# EAGLE design pecl_sampler_v3 (EAGLE 9.4.1)
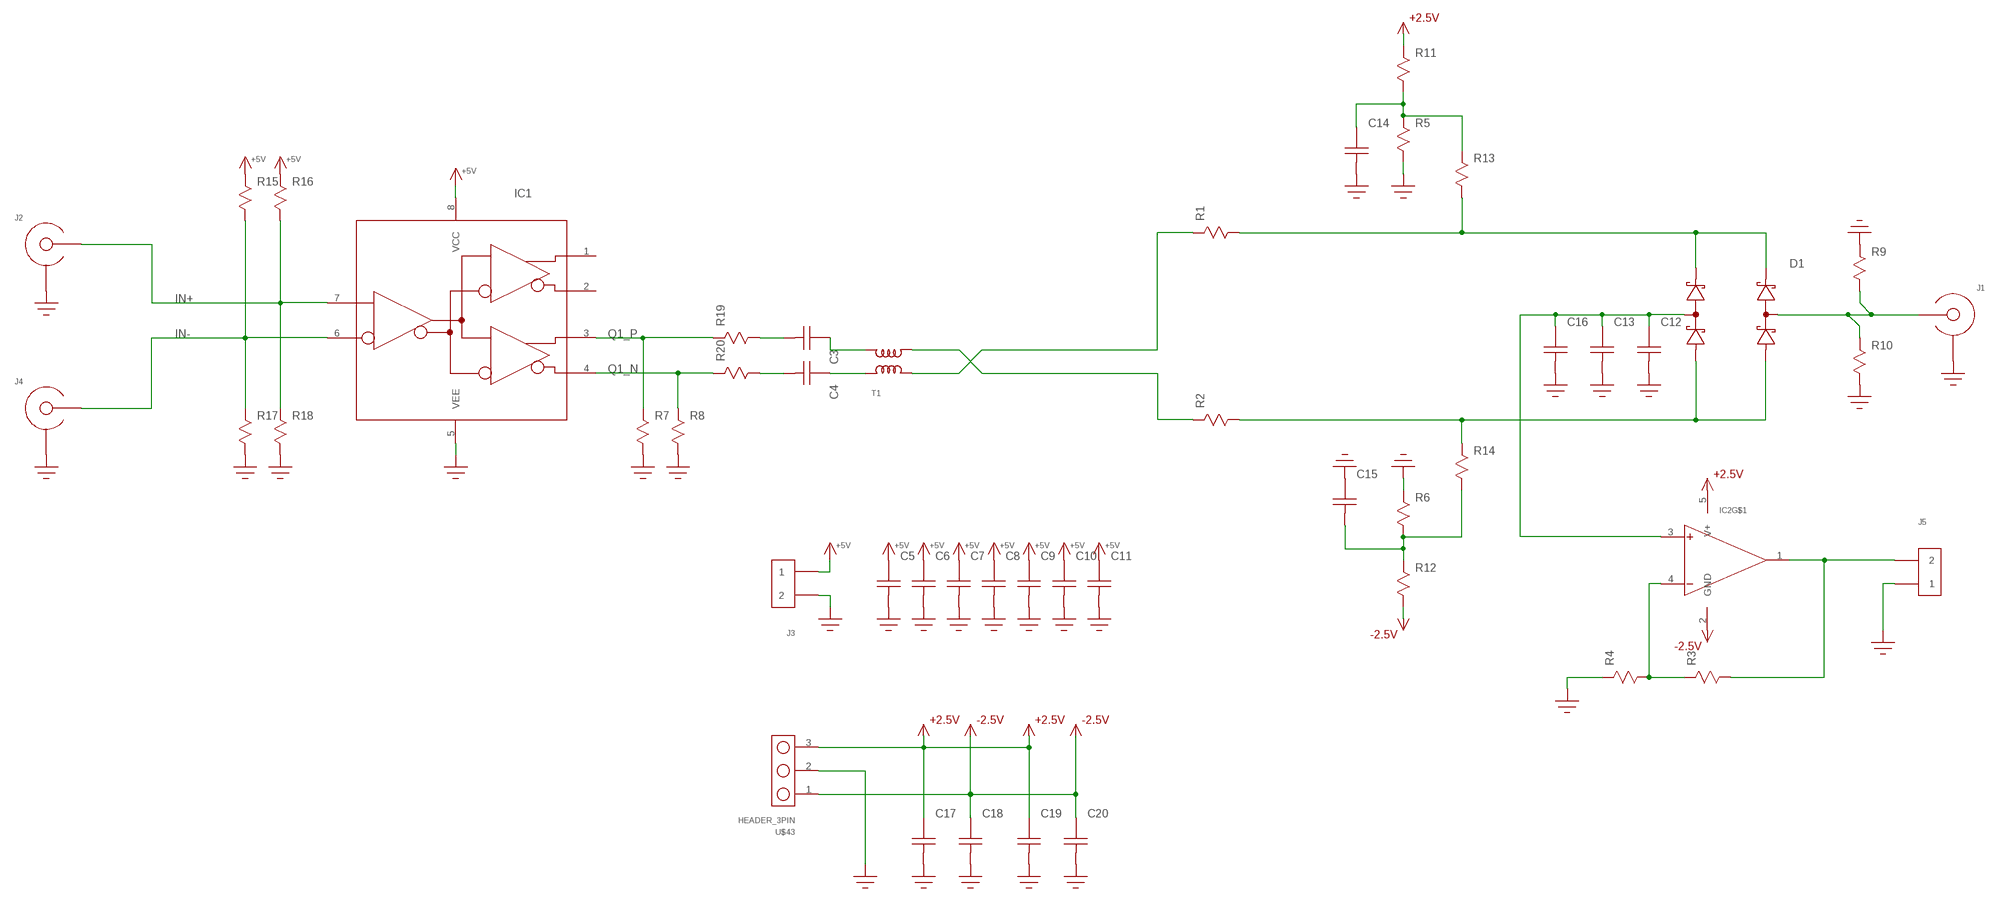
[diagram p0: schematic, sheet 1]

## Parts
C3  C  [C0402]
C4  C  [C0402]
C5  C0603  [C0603]
C6  C0603  [C0603]
C7  C0805  [0805]
C8  C0603  [C0603]
C9  C0603  [C0603]
C10  C0603  [C0603]
C11  C0603  [C0603]
C12  C  [C0402]
C13  C  [C0402]
C14  C  [C0402]
C15  C  [C0402]
C16  C  [C0402]
C17  C0603  [C0603]
C18  C0603  [C0603]
C19  C0603  [C0603]
C20  C0603  [C0603]
D1  SMS3923-081  [SC-88]
IC1  SY10EP89V  [SOIC8]
IC2  MCP6V81  [SOT23-5]
J1  SMA-EDGE-LAUNCH4L-4020-TAPER-FIXED  [SMA_EDGE_LAUNCH_4L_4020_TAPER_FIXED]
J2  SMA-EDGE-LAUNCH4L-4020-TAPER-FIXED  [SMA_EDGE_LAUNCH_4L_4020_TAPER_FIXED]
J3  HEADER_2PIN  [HEADER_2PIN]
J4  SMA-EDGE-LAUNCH4L-4020-TAPER-FIXED  [SMA_EDGE_LAUNCH_4L_4020_TAPER_FIXED]
J5  HEADER_2PIN  [HEADER_2PIN]
R1  R0402  [0402]
R2  R0402  [0402]
R3  R0603  [R0603]
R4  R0603  [R0603]
R5  R0603  [R0603]
R6  R0603  [R0603]
R7  R0603  [R0603]
R8  R0603  [R0603]
R9  R0402  [0402]
R10  R0402  [0402]
R11  R0603  [R0603]
R12  R0603  [R0603]
R13  R0402  [0402]
R14  R0402  [0402]
R15  R0603  [R0603]
R16  R0603  [R0603]
R17  R0603  [R0603]
R18  R0603  [R0603]
R19  R0402  [0402]
R20  R0402  [0402]
T1  MABA007159  [MABAES0061]
U$43  HEADER_3PIN  [HEADER_3PIN]

## Nets
+2.5V: C17.P$2 C19.P$2 IC2.5(V+) R11.P$1 U$43.3
+5V: C5.P$2 C6.P$2 C7.P$2 C8.P$2 C9.P$2 C10.P$2 C11.P$2 IC1.8(VCC) J3.1 R15.P$1 R16.P$1
-2.5V: C18.P$2 C20.P$2 IC2.2(GND) R12.P$2 U$43.1
GND: C5.P$1 C6.P$1 C7.P$1 C8.P$1 C9.P$1 C10.P$1 C11.P$1 C12.1 C13.1 C14.1 C15.2 C16.1 C17.P$1 C18.P$1 C19.P$1 C20.P$1 IC1.5(VEE) J1.BOTTOM_GND(SHIELD) J1.GND@1(SHIELD) J1.GND@2(SHIELD) J1.GND@3(SHIELD) J1.GND@4(SHIELD) J1.GND@5(SHIELD) J1.GND@6(SHIELD) J1.GND@7(SHIELD) J1.GND@8(SHIELD) J1.GND@14(SHIELD) J1.GND@15(SHIELD) J1.GND@16(SHIELD) J1.GND@17(SHIELD) J1.GND_PAD1(SHIELD) J1.GND_PAD2(SHIELD) J1.P$1(SHIELD) J1.P$2(SHIELD) J2.BOTTOM_GND(SHIELD) J2.GND@1(SHIELD) J2.GND@2(SHIELD) J2.GND@3(SHIELD) J2.GND@4(SHIELD) J2.GND@5(SHIELD) J2.GND@6(SHIELD) J2.GND@7(SHIELD) J2.GND@8(SHIELD) J2.GND@14(SHIELD) J2.GND@15(SHIELD) J2.GND@16(SHIELD) J2.GND@17(SHIELD) J2.GND_PAD1(SHIELD) J2.GND_PAD2(SHIELD) J2.P$1(SHIELD) J2.P$2(SHIELD) J3.2 J4.BOTTOM_GND(SHIELD) J4.GND@1(SHIELD) J4.GND@2(SHIELD) J4.GND@3(SHIELD) J4.GND@4(SHIELD) J4.GND@5(SHIELD) J4.GND@6(SHIELD) J4.GND@7(SHIELD) J4.GND@8(SHIELD) J4.GND@14(SHIELD) J4.GND@15(SHIELD) J4.GND@16(SHIELD) J4.GND@17(SHIELD) J4.GND_PAD1(SHIELD) J4.GND_PAD2(SHIELD) J4.P$1(SHIELD) J4.P$2(SHIELD) J5.1 R4.P$1 R5.P$2 R6.P$1 R7.P$2 R8.P$2 R9.1 R10.2 R17.P$2 R18.P$2 U$43.2
IN+: IC1.7(D) J2.CENTER@1(CENTER) J2.P$3(CENTER) R16.P$2 R18.P$1
IN-: IC1.6(!D!) J4.CENTER@1(CENTER) J4.P$3(CENTER) R15.P$2 R17.P$1
N$1: C14.2 R5.P$1 R11.P$2 R13.1
N$2: C12.2 C13.2 C16.2 D1.5(COMMON1) IC2.3(+)
N$3: C4.2 T1.5
N$4: D1.2(COMMON0) J1.CENTER@1(CENTER) J1.P$3(CENTER) R9.2 R10.1
N$5: C15.1 R6.P$2 R12.P$1 R14.2
N$6: C3.2 T1.4
N$7: D1.3(CATHODE0) D1.4(CATHODE1) R1.2 R13.2
N$8: R1.1 T1.1
N$9: R2.1 T1.3
N$10: D1.1(ANODE0) D1.6(ANODE1) R2.2 R14.1
N$11: C3.1 R19.2
N$12: C4.1 R20.2
N$13: IC2.4(-) R3.P$1 R4.P$2
N$16: IC2.1(OUT) J5.2 R3.P$2
Q1_N: IC1.4(!Q1!) R8.P$1 R20.1
Q1_P: IC1.3(Q1) R7.P$1 R19.1
Unconnected: IC1.1(Q0) IC1.2(!Q0!)

## Library data of the parts
C3-C20 = yapo:C
D1 = yapo:SMS3923-081
IC1 = yapo:SY10EP89V
IC2 = yapo:MCP6V81
J1 J2 J4 = sma_footprint_2l:SMA-EDGE-LAUNCH
J3 J5 = yapo:HEADER_2PIN
R1-R20 = yapo:R
T1 = yapo:MABA007159
U$43 = yapo:HEADER_3PIN

## Net classes
1 100_ohm_diff: width 0.711 mm, clearance 0.152 mm
2 30-6: width 0.762 mm, clearance 0.152 mm

## Board
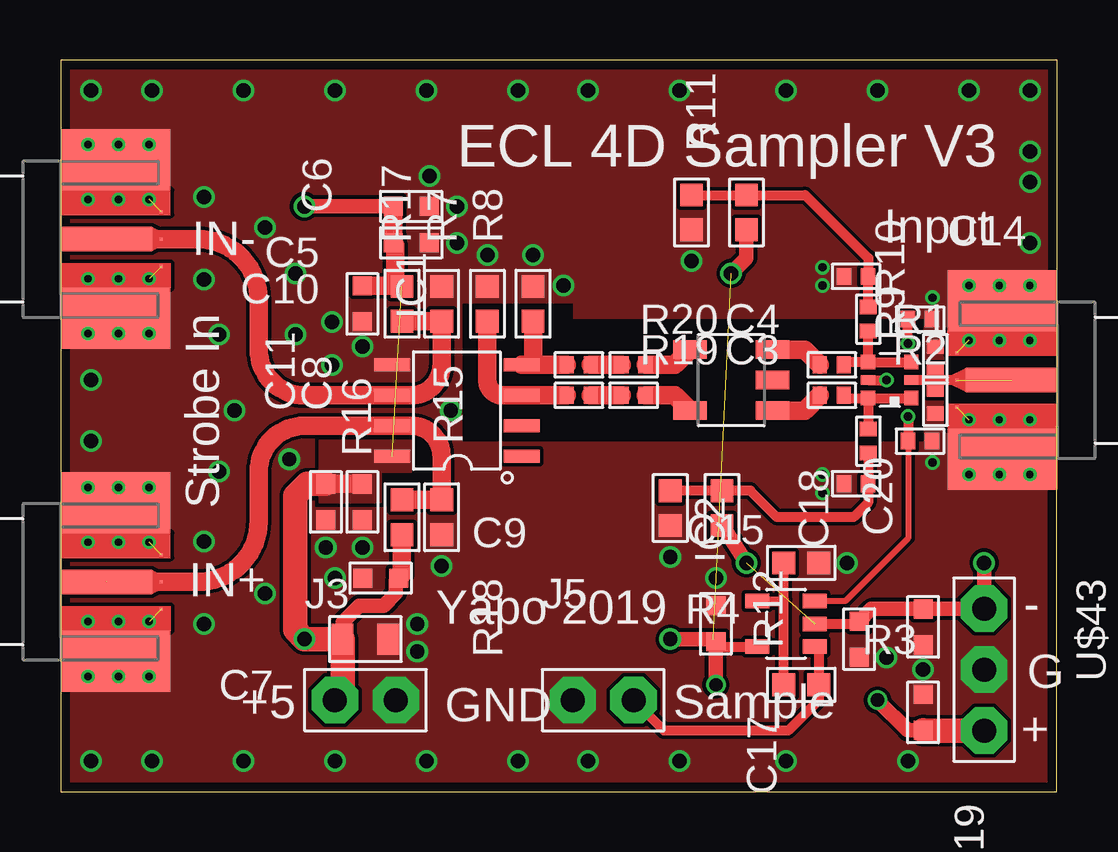
[diagram p1: board, top side]
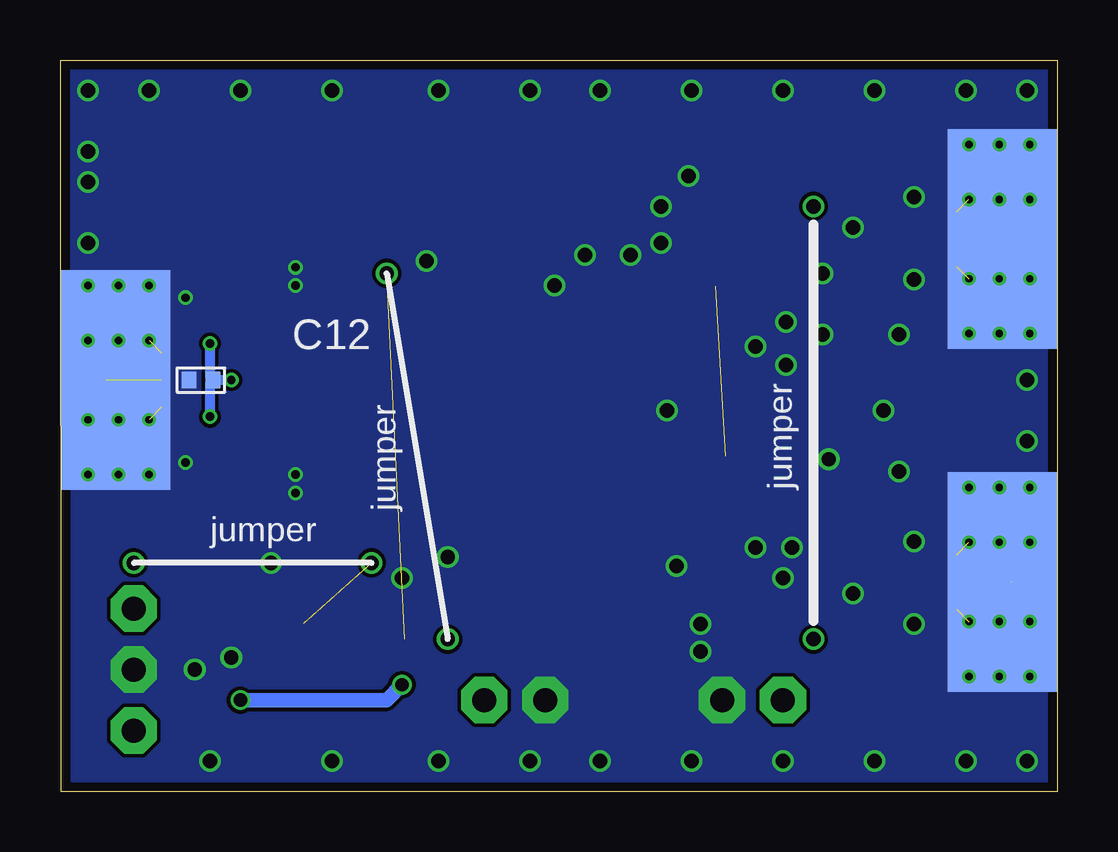
[diagram p2: board, bottom side, seen from below]

Size 41.53 x 30.48 mm. Coordinates in mm from the lower left corner, seen from the top.
Outline: 0,0 41.51,0 41.53,30.48 0,30.48 0,0
Copper layers (1*16): Top 0.035559375mm / dielectric 1.6mm / Bottom 0.035559375mm
Design rules "oshpark-2layer *": minimum track width 6mil, minimum drill 10mil, track to track 6mil, track to pad 6mil, pad to pad 6mil, via to via 6mil, smd to smd 6mil, copper to edge 15mil, drill to drill 6mil, minimum pad ring 5mil, minimum via ring 5mil, stop-mask expansion 2.5mil, vias tented up to drill 25mil, thermal gap 10mil

### Footprints (pad centres in the part's own frame; a part is rotated, then mirrored left to right if it is on the bottom)
C0402 = smd 0.6 x 0.7: 1 -0.5,0; 2 0.5,0
C0603 = smd 0.8 x 0.8: P$1 -0.75,0; P$2 0.75,0
0805 = smd 0.9 x 1.3: P$1 -0.95,0; P$2 0.95,0
SC-88 = smd 0.6 x 0.6: 1 -0.9,0.75; 3 -0.9,-0.75; 4 0.9,-0.75; 6 0.9,0.75 | smd 0.6 x 0.4: 2 -0.9,0; 5 0.9,0
SOIC8 = smd 0.55 x 1.5: 1 -1.905,-2.7; 2 -0.635,-2.7; 3 0.635,-2.7; 4 1.905,-2.7; 5 1.905,2.7; 6 0.635,2.7; 7 -0.635,2.7; 8 -1.905,2.7
SOT23-5 = smd 0.6 x 1: 1 -0.95,-1.2; 2 0,-1.2; 3 0.95,-1.2; 4 0.95,1.2; 5 -0.95,1.2
SMA_EDGE_LAUNCH_4L_4020_TAPER_FIXED = smd 4.572 x 9.144 bottom: BOTTOM_GND 2.286,0 | smd 3.81 x 1.016: CENTER@1 1.905,0 | drill 0.3: GND@1 1.143,3.937; GND@2 3.683,3.937; GND@3 1.143,1.651; GND@4 3.683,1.651; GND@5 1.143,-1.651; GND@6 3.683,-1.651; GND@7 1.143,-3.937; GND@8 3.683,-3.937; GND@14 2.413,3.937; GND@15 2.413,-3.937; GND@16 2.413,-1.651; GND@17 2.413,1.651 | smd 4.572 x 2.54: GND_PAD1 2.286,3.302; GND_PAD2 2.286,-3.302 | smd 0.127 x 0.127: P$1 4.191,1.143; P$2 4.191,-1.143; P$3 4.191,0
HEADER_2PIN = drill 1 pad 1.93 octagon: 1 -1.27,0; 2 1.27,0
0402 = smd 0.6 x 0.7: 1 -0.5,0; 2 0.5,0
R0603 = smd 0.95 x 0.95: P$1 -0.725,0; P$2 0.725,0
MABAES0061 = smd 0.76 x 1.4: 1 1.27,-1.715; 2 0,-1.715; 3 -1.27,-1.715; 4 -1.27,1.715; 5 1.27,1.715
HEADER_3PIN = drill 1 pad 1.93 octagon: 1 -2.54,0; 2 0,0; 3 2.54,0

### Placement (x,y rotation side)
C3  23.88,16.51 0 top
C4  23.88,17.78 0 top
C5  14.61,24.38 180 top
C6  12.57,20.32 90 top
C7  12.7,6.35 180 top
C8  12.57,12.06 90 top
C9  13.34,8.89 0 top
C10  14.61,22.86 180 top
C11  11.05,12.06 90 top
C12  35.69,17.14 0 bottom
C13  35.81,19.68 180 top
C14  33.15,21.46 0 top
C15  33.15,12.83 180 top
C16  35.81,14.61 180 top
C17  27.3,6.99 270 top
C18  33.27,6.35 90 top
C19  35.94,3.3 270 top
C20  35.94,6.86 90 top
D1  34.54,17.14 180 top
IC1  16.51,15.88 90 top
IC2  30.23,6.99 90 top
J1  41.53,17.14 180 top
J2  0,8.73 0 top
J3  12.7,3.81 0 top
J4  0,23.02 0 top
J5  22.61,3.81 0 top
R1  32.13,17.78 0 top
R2  32.13,16.51 0 top
R3  30.86,4.45 0 top
R4  30.86,9.53 180 top
R5  26.29,24.13 270 top
R6  25.4,11.81 90 top
R7  17.78,20.32 90 top
R8  19.68,20.32 90 top
R9  36.45,16.26 90 top
R10  36.45,18.03 90 top
R11  28.57,24.13 90 top
R12  27.56,11.81 270 top
R13  33.66,19.68 270 top
R14  33.66,14.61 270 top
R15  14.22,20.32 270 top
R16  14.22,11.43 90 top
R17  15.88,20.32 90 top
R18  15.88,11.43 270 top
R19  21.59,16.51 0 top
R20  21.59,17.78 0 top
T1  27.94,17.14 90 top
U$43  38.48,5.08 270 top

### Tracks (layer width: path | path; a pad name or v marks a point on that pad's centre or on a via)
+2.5V  (via drill 0.55, 0.6)  (1 unrouted)
  Top 0.406: IC2.5 27.5,6.04 C17.P$2
  Top 0.61: C19.P$2 35.29,2.55 v34.04,3.81 | v27.3,4.45 C17.P$2 | R11.P$1 28.57,22.23 v27.94,21.59 | C17.P$2 27.19,6.35 | 27.19,6.35 v25.4,6.35 27.19,6.35 | C17.P$2 27.19,6.35
  Top 1.016: U$43.3 35.95,2.54 C19.P$2
  Bottom 0.61: v34.04,3.81 27.94,3.81 v27.3,4.45
+5V  (via drill 0.6)  (1 unrouted)
  Top 0.61: C5.P$2 v10.16,24.38 | C9.P$2 13.97,8.78 13.97,8.26 13.46,7.75 12.45,7.75 11.75,7.05 C7.P$2
  Top 0.762: C8.P$2 C11.P$2 | C6.P$2 13.95,21.07 13.95,21.32 | 13.95,21.32 R15.P$1 | 13.95,21.32 13.95,22.77 C10.P$2 C5.P$2 | R16.P$1 14.22,9.03 C9.P$2
  Top 1.016: C11.P$2 10.28,12.81 9.78,12.32 9.78,6.73 v10.16,6.35 C7.P$2 11.75,4.13 J3.1
  pour Top (no thermals): 10.79,12.06 13.34,12.06 13.34,13.34 14.61,13.34 14.61,14.61 10.79,14.61
-2.5V  (via drill 0.6)  (1 unrouted)
  Top 0.406: IC2.2 33.16,6.99 C18.P$2
  Top 0.61: C18.P$2 33.78,7.61 C20.P$2 35.95,7.62 U$43.1 v38.48,9.53 | R12.P$2 v28.57,9.53
  Bottom 0.61: 37.85,7.62 U$43.1
GND  (via drill 0.35, 0.6)  (6 unrouted)
  other vias: 7.62,29.21 11.43,29.21 15.24,29.21 19.05,29.21 21.97,29.21 21.97,1.27 19.05,1.27 15.24,1.27 11.43,1.27 7.62,1.27 25.78,29.21 17.78,22.35 19.68,22.35 16.51,22.86 11.3,19.56 12.57,18.54 11.3,17.78 12.57,10.16 11.05,10.16 15.88,9.4 20.95,21.08 14.86,6.99 14.86,5.84 9.53,13.84 16.26,15.88 16.51,24.38 36.32,13.72 36.32,20.57 35.94,5.08 27.3,8.89 34.42,5.59 32.77,9.53 15.37,25.65 3.81,29.21 3.81,1.27 1.27,1.27 1.27,14.61 1.27,17.14 1.27,29.21 30.23,29.21 34.04,29.21 37.85,29.21 40.39,29.21 40.39,26.67 40.39,25.4 40.39,22.86 35.31,1.27 25.78,1.27 11.43,8.89 30.23,1.27 5.97,24.77 5.97,21.34 8.51,23.5 9.78,21.59 9.78,19.05 6.6,19.05 7.24,15.88 6.6,13.34 5.97,10.41 5.97,6.99 8.51,8.26 31.75,21.84 31.75,12.45 31.75,13.21 31.75,21.08 26.29,22.1 25.4,9.78
  pour Top (rank 2, no thermals): 0,0 41.53,0 41.53,30.48 0,30.48
  pour Bottom (no thermals): 0,0 41.53,0 41.53,30.48 0,30.48
  cutout Top: 20.83,19.68 20.83,14.61 35.94,14.61 35.94,19.68
  cutout Top: 21.34,20.32 21.34,14.61 16.76,14.61 16.76,20.32
IN+  (1 unrouted)
  Top 0.762: R16.P$2 R18.P$1 15.88,13.97 arc90 14.61,15.24 IC1.7 10.16,15.24 arc90 8.26,13.34 8.26,11.27 arc-90 5.71,8.73 J2.P$3 J2.CENTER@1 1.91,8.76
IN-
  Top 0.762: R15.P$2 R17.P$1 15.88,17.78 arc-90 14.61,16.51 IC1.6 10.16,16.51 arc-90 8.26,18.41 8.26,20.48 arc90 5.71,23.02 J4.P$3 J4.CENTER@1
N$1
  Top 0.406: R5.P$1 R11.P$2 31.02,24.86 33.66,22.23 C14.2 | C14.2 | R13.1 C14.2
N$2  (via drill 0.35)
  Top 0.254: IC2.3 32.7,7.93 35.31,10.55 C16.2
  Top 0.406: D1.5 v34.42,17.14 | v35.31,18.67 C13.2 | v35.31,15.62 v35.31,15.61 C16.2
  Bottom 0.406: v34.42,17.14 C12.2 | C12.2 35.31,17.27 v35.31,18.66 v35.31,18.67 | C12.2 35.31,17.02 v35.31,15.63 v35.31,15.62
N$3
  Top 0.762: C4.2 25.59,17.78 T1.5
N$4  (1 unrouted)
  Top 0.406: J1.P$3 36.45,17.14 | 36.45,17.14 D1.2 | R10.1 36.45,17.14 | R9.2 36.45,17.14
N$5
  Top 0.406: R6.P$2 R12.P$1 28.74,12.54 29.84,11.43 33.04,11.43 33.65,12.04 C15.1 R14.2
N$6
  Top 0.762: C3.2 25.59,16.51 T1.4
N$7
  Top 0.406: D1.4 D1.3 | D1.4 32.75,17.89 R1.2 | D1.4 33.66,17.91 R13.2
N$8
  Top 0.762: T1.1 31,18.41 R1.1
N$9
  Top 0.762: T1.3 31,15.88 R2.1
N$10
  Top 0.254: R2.2 32.75,16.39
  Top 0.406: D1.6 D1.1 | 32.75,16.39 D1.6 | D1.6 33.66,16.38 R14.1
N$11
  Top 0.762: R19.2 C3.1
N$12
  Top 0.762: R20.2 C4.1
N$13
  Top 0.406: R3.P$1 30.14,8 | 30.14,8 R4.P$2 | IC2.4 30.07,7.93 30.14,8
N$16
  Top 0.406: IC2.1 31.59,5.88 R3.P$2 31.59,3.81 30.32,2.54 25.15,2.54 J5.2
Q1_N
  Top 0.762: R8.P$1 19.68,17.78 IC1.4 R20.1
Q1_P
  Top 0.762: R7.P$1 17.78,17.14 arc90 18.41,16.51 IC1.3 R19.1

### Text on the board
tPlace: ECL 4D Sampler V3 | Input | IN- | Strobe In | IN+ | Yapo 2019 | - | G | +5 | GND | Sample | +
bPlace: jumper | jumper | jumper